# Altium schematic sheet PowerBuck.SchDoc
size A4
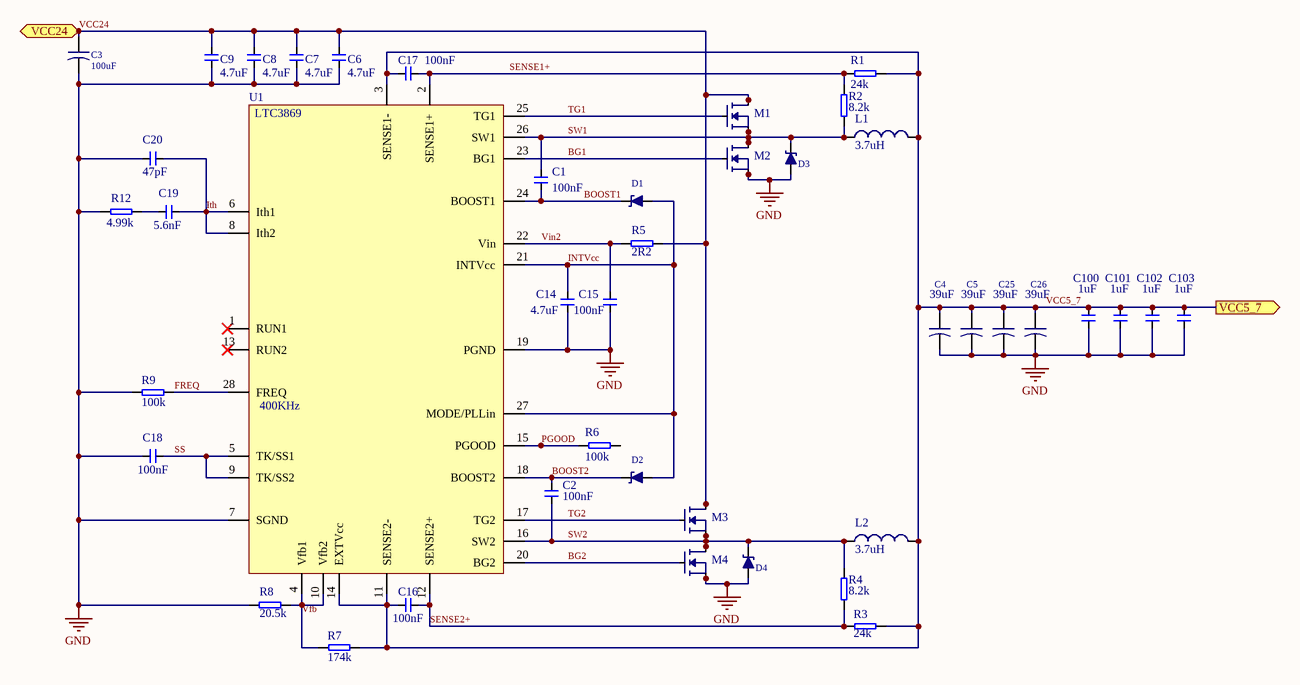
[diagram p0: PowerBuck.SchDoc]

## Parts
C1  100nF  [CAP 0603/1608]
C2  100nF  [CAP 0603/1608]
C3  100uF  [CAPAE115102X102N]
C4  39uF  [CAPAE6053X59M]
C5  39uF  [CAPAE6053X59M]
C6  4.7uF  [CAP_1206]
C7  4.7uF  [CAP_1206]
C8  4.7uF  [CAP_1206]
C9  4.7uF  [CAP_1206]
C14  4.7uF  [CAP_1206]
C15  100nF  [CAP 0603/1608]
C16  100nF  [CAP 0603/1608]
C17  100nF  [CAP 0603/1608]
C18  100nF  [CAP 0603/1608]
C19  5.6nF  [CAP 0603/1608]
C20  47pF  [CAP 0603/1608]
C25  39uF  [CAPAE6053X59M]
C26  39uF  [CAPAE6053X59M]
C100  1uF  [CAP1206]
C101  1uF  [CAP1206]
C102  1uF  [CAP1206]
C103  1uF  [CAP1206]
D1  SDM10K45  [DIOM1713X11N]  (value not drawn)
D2  SDM10K45  [DIOM1713X11N]  (value not drawn)
D3  SDM10K45  [DIOM2618X11N]  (value not drawn)
D4  SDM10K45  [DIOM2618X11N]  (value not drawn)
L1  3.7uH  [INDP130128X62N]
L2  3.7uH  [INDP130128X62N]
M1  MOSFET-N  [INF-PG-TDSON-8-1_V]  (value not drawn)
M2  MOSFET-N  [INF-PG-TDSON-8-1_V]  (value not drawn)
M3  MOSFET-N  [INF-PG-TDSON-8-1_V]  (value not drawn)
M4  MOSFET-N  [INF-PG-TDSON-8-1_V]  (value not drawn)
R1  24k  [RES 0603/1608]
R2  8.2k  [RES 0603/1608]
R3  24k  [RES 0603/1608]
R4  8.2k  [RES 0603/1608]
R5  2R2  [RES 0603/1608]
R6  100k  [RES 0603/1608]
R7  174k  [RES 0603/1608]
R8  20.5k  [RES 0603/1608]
R9  100k  [RES 0603/1608]
R12  4.99k  [RES 0603/1608]
U1  LTC3869  [SOP64P600X175-28N]

## Ports
VCC5_7 (out), VCC24 (in)

## Nets
GND: C3.2 C4.2 C5.2 C6.2 C7.2 C8.2 C9.2 C14.2 C15.2 C18.2 C20.2 C25.2 C26.2 C100.1 C101.2 C102.2 C103.2 D3.2 D4.2 M2.1(S) M2.2(S) M2.3(S) M4.1(S) M4.2(S) M4.3(S) R8.2 R9.2 R12.2 U1.7(SGND) U1.19(PGND)
BG1: M2.4(G) U1.23(BG1)
BG2: M4.4(G) U1.20(BG2)
BOOST1: C1.2 D1.1 U1.24(BOOST1)
BOOST2: C2.1 D2.1 U1.18(BOOST2)
FREQ: R9.1 U1.28(FREQ)
INTVcc: C14.1 D1.2 D2.2 U1.21(INTVcc) U1.27(MODE/PLLin)
Ith: C19.1 C20.1 U1.6(Ith1) U1.8(Ith2)
PGOOD: R6.2 U1.15(PGOOD)
SENSE1+: C17.2 R1.2 R2.2 U1.2(SENSE1+)
SENSE2+: C16.2 R3.1 R4.2 U1.12(SENSE2+)
SS: C18.1 U1.5(TK/SS1) U1.9(TK/SS2)
SW1: C1.1 D3.1 L1.1 M1.1(S) M1.2(S) M1.3(S) M2.5(D) M2.6(D) M2.7(D) M2.8 R2.1 U1.26(SW1)
SW2: C2.2 D4.1 L2.1 M3.1(S) M3.2(S) M3.3(S) M4.5(D) M4.6(D) M4.7(D) M4.8 R4.1 U1.16(SW2)
TG1: M1.4(G) U1.25(TG1)
TG2: M3.4(G) U1.17(TG2)
VCC5_7: C4.1 C5.1 C16.1 C17.1 C25.1 C26.1 C100.2 C101.1 C102.1 C103.1 L1.2 L2.2 R1.1 R3.2 R7.2 U1.3(SENSE1-) U1.11(SENSE2-) U1.14(EXTVcc) ; port VCC5_7
VCC24: C3.1 C6.1 C7.1 C8.1 C9.1 M1.5(D) M1.6(D) M1.7(D) M1.8 M3.5(D) M3.6(D) M3.7(D) M3.8 R5.1 ; port VCC24
Vfb: R7.1 R8.1 U1.4(Vfb1) U1.10(Vfb2)
Vin2: C15.1 R5.2 U1.22(Vin)
NetC19_2: C19.2 R12.1

Not connected (* = marked no-connect by the designer): R6 1; U1 1(RUN1)* 13(RUN2)*

## Notes on the sheet
- (near U1) 400KHz

## Library data of the parts
C1 C2 C6-C9 C14-C20 C100-C103 = CAP: Capacitor; Note: *; Desc: *
  C1 C2 C15-C18: Value: 100nF
  C6-C9 C14: Value: 4.7uF
  C19: Value: 5.6nF
  C20: Value: 47pF
  C100-C103: Value: 1uF
C3-C5 C25 C26 = E CAP
  C3: Value: 100uF
  C4 C5 C25 C26: Value: 39uF
D1-D4 = D Schottky
L1 L2 = Inductor: Code_IEC: 1005; Published: 8-Jun-2000; LatestRevisionDate: 29-May-2009; LatestRevisionNote: IPC-7351 Footprint Added.; PackageReference: 0402-A; Publisher: Altium Limited; PackageDescription: Chip Inductor; Code_JEITA: 0402; Value: 3.7uH
R1-R9 R12 = RES: Resistor; Note: *; Desc: *
  R1 R3: Value: 24k
  R2 R4: Value: 8.2k
  R5: Value: 2R2
  R6 R9: Value: 100k
  R7: Value: 174k
  R8: Value: 20.5k
  R12: Value: 4.99k